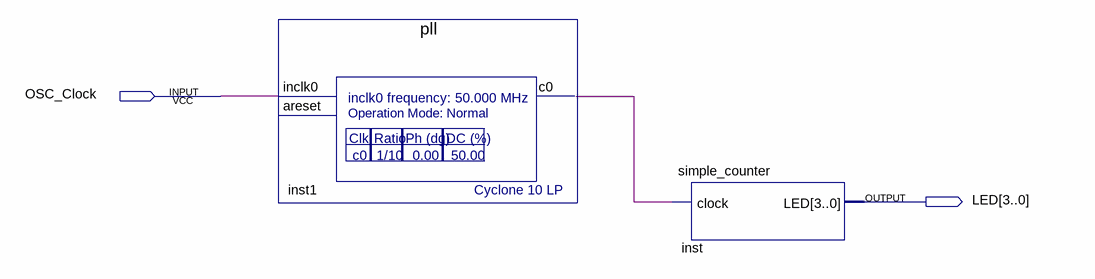
[diagram p0: schematic sheet]
// Quartus schematic simple_blinky.bdf as structural Verilog: 2 symbols, 2 pins
module simple_blinky (
  input  OSC_Clock,
  output [3:0] LED
);

  wire inst1_c0;

  pll inst1 (.inclk0(OSC_Clock), .c0(inst1_c0));  // open: areset
  simple_counter inst (.clock(inst1_c0), .LED(LED));
endmodule
